# EAGLE schematic main_controller (EAGLE 9.6.2)
AUTHOR: Usama Ali, Jeldrik Lindner; GENERATION: pasta; TITLE: Mainboard; VERSION: 06

## Sheet 1 of 3: Microcontroller
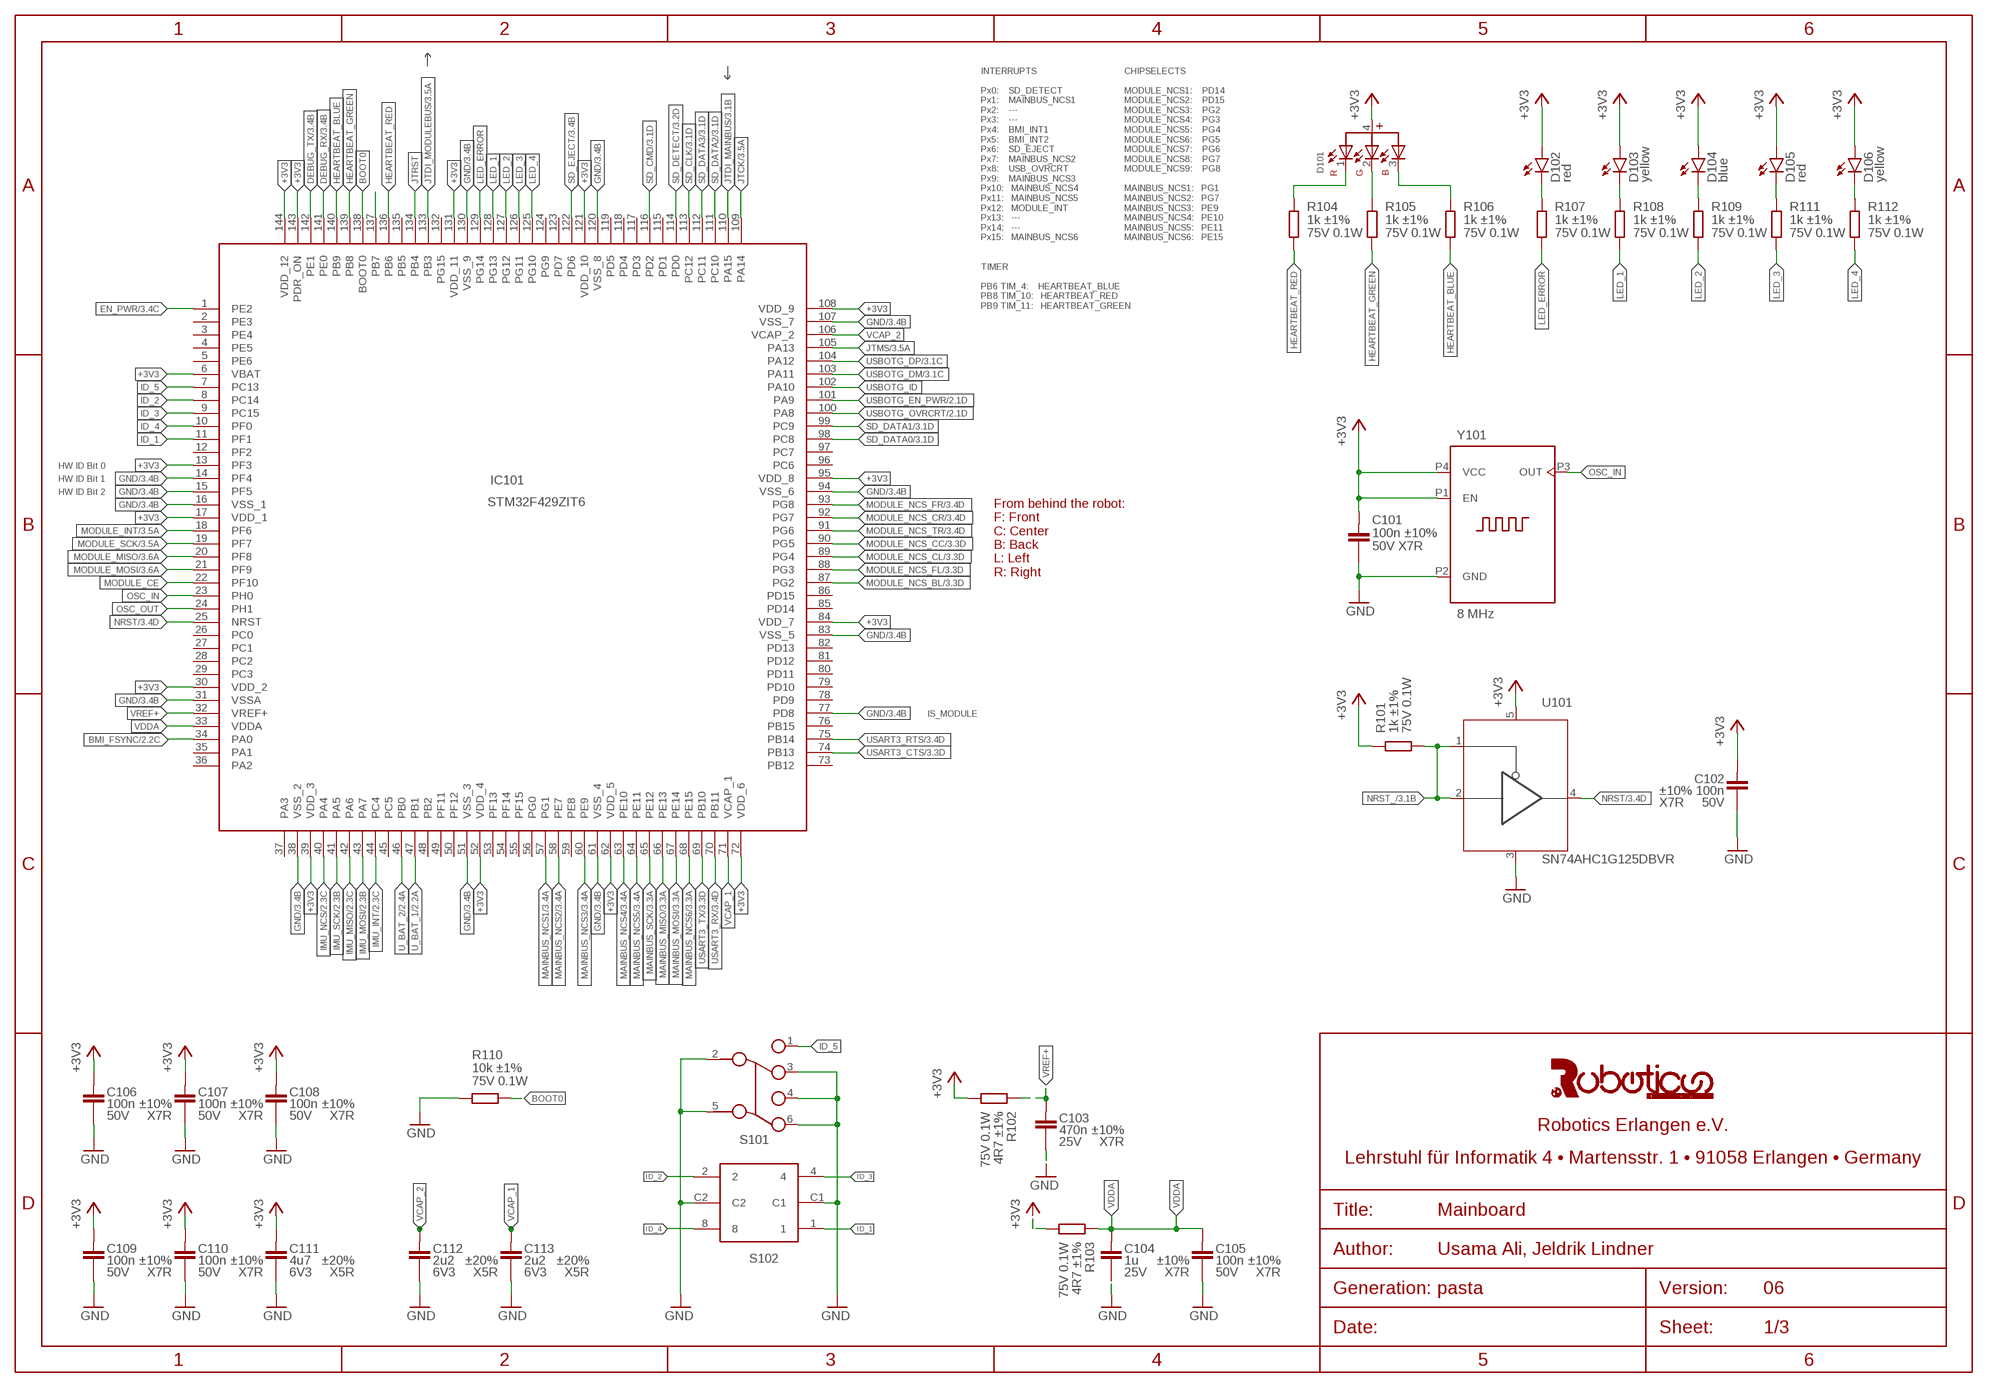
[diagram p0: schematic, sheet 1]

### Parts
C101  100n ±10% 50V X7R  C(100NF,50V,0603)  [C0603]
C102  100n ±10% 50V X7R  C(100NF,50V,0603)  [C0603]
C103  470n ±10% 25V X7R  C(470NF,25V,0603)  [C0603]
C104  1u ±10% 25V X7R  C(1.0UF,25V,0603)  [C0603]
C105  100n ±10% 50V X7R  C(100NF,50V,0603)  [C0603]
C106  100n ±10% 50V X7R  C(100NF,50V,0603)  [C0603]
C107  100n ±10% 50V X7R  C(100NF,50V,0603)  [C0603]
C108  100n ±10% 50V X7R  C(100NF,50V,0603)  [C0603]
C109  100n ±10% 50V X7R  C(100NF,50V,0603)  [C0603]
C110  100n ±10% 50V X7R  C(100NF,50V,0603)  [C0603]
C111  4u7 ±20% 6V3 X5R  C(4.7UF,6.3V,0603)  [C0603]
C112  2u2 ±20% 6V3 X5R  C(2.2UF,6.3V,0603)  [C0603]
C113  2u2 ±20% 6V3 X5R  C(2.2UF,6.3V,0603)  [C0603]
D101  WL-SFCD_0606_150066M153000  [WL-SFCX_0606]
D102  red  LED-RED-CHIPLED_0805  [CHIPLED_0805]
D103  yellow  LED-YELLOW-CHIPLED_0805  [CHIPLED_0805]
D104  blue  LED-BLUE-CHIPLED_0805  [CHIPLED_0805]
D105  red  LED-RED-CHIPLED_0805  [CHIPLED_0805]
D106  yellow  LED-YELLOW-CHIPLED_0805  [CHIPLED_0805]
IC101  STM32F429ZIT6  [QFP50P2200X2200X160-144N]
R101  1k ±1% 75V 0.1W  R(1.0K,75V,0.1W,0603)  [R0603]
R102  4R7 ±1% 75V 0.1W  R(4.7R,75V,0.1W,0603)  [R0603]
R103  4R7 ±1% 75V 0.1W  R(4.7R,75V,0.1W,0603)  [R0603]
R104  1k ±1% 75V 0.1W  R(1.0K,75V,0.1W,0603)  [R0603]
R105  1k ±1% 75V 0.1W  R(1.0K,75V,0.1W,0603)  [R0603]
R106  1k ±1% 75V 0.1W  R(1.0K,75V,0.1W,0603)  [R0603]
R107  1k ±1% 75V 0.1W  R(1.0K,75V,0.1W,0603)  [R0603]
R108  1k ±1% 75V 0.1W  R(1.0K,75V,0.1W,0603)  [R0603]
R109  1k ±1% 75V 0.1W  R(1.0K,75V,0.1W,0603)  [R0603]
R110  10k ±1% 75V 0.1W  R(10K,75V,0.1W,0603)  [R0603]
R111  1k ±1% 75V 0.1W  R(1.0K,75V,0.1W,0603)  [R0603]
R112  1k ±1% 75V 0.1W  R(1.0K,75V,0.1W,0603)  [R0603]
S101  452403012014  [452403012014]
S102  428542320816  [428542320816]
U101  SN74AHC1G125DBVR  [SOT23-5]
Y101  8 MHz  830207192009  [830207192009]

### Nets
+3V3: C101.1 C102.1 C106.1 C107.1 C108.1 C109.1 C110.1 C111.1 D101.4 D102.A D103.A D104.A D105.A D106.A IC101.6(VBAT) IC101.13(PF3) IC101.17(VDD_1) IC101.30(VDD_2) IC101.39(VDD_3) IC101.52(VDD_4) IC101.62(VDD_5) IC101.72(VDD_6) IC101.84(VDD_7) IC101.95(VDD_8) IC101.108(VDD_9) IC101.121(VDD_10) IC101.131(VDD_11) IC101.143(PDR_ON) IC101.144(VDD_12) R101.2 R102.1 R103.1 U101.5(VCC) Y101.P1(EN) Y101.P4(VCC) ; also sheet 2,3
BMI_FSYNC: IC101.34(PA0) ; also sheet 2
BOOT0: IC101.138(BOOT0) R110.1
DEBUG_RX: IC101.141(PE0) ; also sheet 3
DEBUG_TX: IC101.142(PE1) ; also sheet 3
EN_PWR: IC101.1(PE2) ; also sheet 3
GND: C101.2 C102.2 C103.2 C104.2 C105.2 C106.2 C107.2 C108.2 C109.2 C110.2 C111.2 C112.2 C113.2 IC101.14(PF4) IC101.15(PF5) IC101.16(VSS_1) IC101.31(VSSA) IC101.38(VSS_2) IC101.51(VSS_3) IC101.61(VSS_4) IC101.77(PD8) IC101.83(VSS_5) IC101.94(VSS_6) IC101.107(VSS_7) IC101.120(VSS_8) IC101.130(VSS_9) R110.2 S101.2 S101.3 S101.4 S101.5 S101.6 S102.C1 S102.C2 U101.3(GND) Y101.P2(GND) ; also sheet 2,3
HEARTBEAT_BLUE: IC101.140(PB9) R106.1
HEARTBEAT_GREEN: IC101.139(PB8) R105.1
HEARTBEAT_RED: IC101.136(PB6) R104.1
ID_1: IC101.11(PF1) S102.1
ID_2: IC101.8(PC14) S102.2
ID_3: IC101.9(PC15) S102.4
ID_4: IC101.10(PF0) S102.8
ID_5: IC101.7(PC13) S101.1
IMU_INT: IC101.44(PC4) ; also sheet 2,3
IMU_MISO: IC101.42(PA6) ; also sheet 2,3
IMU_MOSI: IC101.43(PA7) ; also sheet 2,3
IMU_NCS: IC101.40(PA4) ; also sheet 2,3
IMU_SCK: IC101.41(PA5) ; also sheet 2,3
JTCK: IC101.109(PA14) ; also sheet 3
JTDI_MAINBUS: IC101.110(PA15) ; also sheet 3
JTDI_MODULEBUS: IC101.133(PB3) ; also sheet 3
JTMS: IC101.105(PA13) ; also sheet 3
JTRST: IC101.134(PB4)
LED_1: IC101.128(PG13) R108.1
LED_2: IC101.127(PG12) R109.1
LED_3: IC101.126(PG11) R111.1
LED_4: IC101.125(PG10) R112.1
LED_ERROR: IC101.129(PG14) R107.1
MAINBUS_MISO: IC101.66(PE13) ; also sheet 3
MAINBUS_MOSI: IC101.67(PE14) ; also sheet 3
MAINBUS_NCS1: IC101.57(PG1) ; also sheet 3
MAINBUS_NCS2: IC101.58(PE7) ; also sheet 3
MAINBUS_NCS3: IC101.60(PE9) ; also sheet 3
MAINBUS_NCS4: IC101.63(PE10) ; also sheet 3
MAINBUS_NCS5: IC101.64(PE11) ; also sheet 3
MAINBUS_NCS6: IC101.68(PE15) ; also sheet 3
MAINBUS_SCK: IC101.65(PE12) ; also sheet 3
MODULE_CE: IC101.22(PF10)
MODULE_INT: IC101.18(PF6) ; also sheet 3
MODULE_MISO: IC101.20(PF8) ; also sheet 3
MODULE_MOSI: IC101.21(PF9) ; also sheet 3
MODULE_NCS_BL: IC101.87(PG2) ; also sheet 3
MODULE_NCS_CC: IC101.90(PG5) ; also sheet 3
MODULE_NCS_CL: IC101.89(PG4) ; also sheet 3
MODULE_NCS_CR: IC101.92(PG7) ; also sheet 3
MODULE_NCS_FL: IC101.88(PG3) ; also sheet 3
MODULE_NCS_FR: IC101.93(PG8) ; also sheet 3
MODULE_NCS_TR: IC101.91(PG6) ; also sheet 3
MODULE_SCK: IC101.19(PF7) ; also sheet 3
N$7: D102.C R107.2
N$9: D103.C R108.2
N$10: D104.C R109.2
N$11: IC101.137(PB7)
N$12: D101.1(R) R104.2
N$13: D101.2(G) R105.2
N$14: D101.3(B) R106.2
N$20: D105.C R111.2
N$21: D106.C R112.2
NRST: IC101.25(NRST) U101.4(O) ; also sheet 3
NRST_: R101.1 U101.1(OE) U101.2(I) ; also sheet 3
OSC_IN: IC101.23(PH0) Y101.P3(OUT)
OSC_OUT: IC101.24(PH1)
SD_CLK: IC101.113(PC12) ; also sheet 3
SD_CMD: IC101.116(PD2) ; also sheet 3
SD_DATA0: IC101.98(PC8) ; also sheet 3
SD_DATA1: IC101.99(PC9) ; also sheet 3
SD_DATA2: IC101.111(PC10) ; also sheet 3
SD_DATA3: IC101.112(PC11) ; also sheet 3
SD_DETECT: IC101.114(PD0) ; also sheet 3
SD_EJECT: IC101.122(PD6) ; also sheet 3
U_BAT_1: IC101.47(PB1) ; also sheet 2
U_BAT_2: IC101.46(PB0) ; also sheet 2
USART3_CTS: IC101.74(PB13) ; also sheet 3
USART3_RTS: IC101.75(PB14) ; also sheet 3
USART3_RX: IC101.70(PB11) ; also sheet 3
USART3_TX: IC101.69(PB10) ; also sheet 3
USBOTG_DM: IC101.103(PA11) ; also sheet 3
USBOTG_DP: IC101.104(PA12) ; also sheet 3
USBOTG_EN_PWR: IC101.101(PA9) ; also sheet 2
USBOTG_ID: IC101.102(PA10)
USBOTG_OVRCRT: IC101.100(PA8) ; also sheet 2
VCAP_1: C113.1 IC101.71(VCAP_1)
VCAP_2: C112.1 IC101.106(VCAP_2)
VDDA: C104.1 C105.1 IC101.33(VDDA) R103.2
VREF+: C103.1 IC101.32(VREF+) R102.2
Unconnected: IC101.2(PE3) IC101.3(PE4) IC101.4(PE5) IC101.5(PE6) IC101.12(PF2) IC101.26(PC0) IC101.27(PC1) IC101.28(PC2) IC101.29(PC3) IC101.35(PA1) IC101.36(PA2) IC101.37(PA3) IC101.45(PC5) IC101.48(PB2) IC101.49(PF11) IC101.50(PF12) IC101.53(PF13) IC101.54(PF14) IC101.55(PF15) IC101.56(PG0) IC101.59(PE8) IC101.73(PB12) IC101.76(PB15) IC101.78(PD9) IC101.79(PD10) IC101.80(PD11) IC101.81(PD12) IC101.82(PD13) IC101.85(PD14) IC101.86(PD15) IC101.96(PC6) IC101.97(PC7) IC101.115(PD1) IC101.117(PD3) IC101.118(PD4) IC101.119(PD5) IC101.123(PD7) IC101.124(PG9) IC101.132(PG15) IC101.135(PB5)

### Notes on the sheet
- INTERRUPTS
  
  Px0:    SD_DETECT
  Px1:    MAINBUS_NCS1
  Px2:    ---
  Px3:    ---
  Px4:    BMI_INT1
  Px5:    BMI_INT2
  Px6:    SD_EJECT
  Px7:    MAINBUS_NCS2
  Px8:    USB_OVRCRT
  Px9:    MAINBUS_NCS3
  Px10:   MAINBUS_NCS4
  Px11:   MAINBUS_NCS5
  Px12:   MODULE_INT
  Px13:   ---
  Px14:   ---
  Px15:   MAINBUS_NCS6
- CHIPSELECTS
  
  MODULE_NCS1:    PD14
  MODULE_NCS2:    PD15
  MODULE_NCS3:    PG2
  MODULE_NCS4:    PG3
  MODULE_NCS5:    PG4
  MODULE_NCS6:    PG5
  MODULE_NCS7:    PG6
  MODULE_NCS8:    PG7
  MODULE_NCS9:    PG8
  
  MAINBUS_NCS1:   PG1
  MAINBUS_NCS2:   PG7
  MAINBUS_NCS3:   PE9
  MAINBUS_NCS4:   PE10
  MAINBUS_NCS5:   PE11
  MAINBUS_NCS6:   PE15
- TIMER
  
  PB6 TIM_4:    HEARTBEAT_BLUE
  PB8 TIM_10:   HEARTBEAT_RED
  PB9 TIM_11:   HEARTBEAT_GREEN
- HW ID Bit 0
- HW ID Bit 1
- HW ID Bit 2
- From behind the robot:
  F: Front
  C: Center
  B: Back
  L: Left
  R: Right
- IS_MODULE

## Sheet 2 of 3: Interface Driver
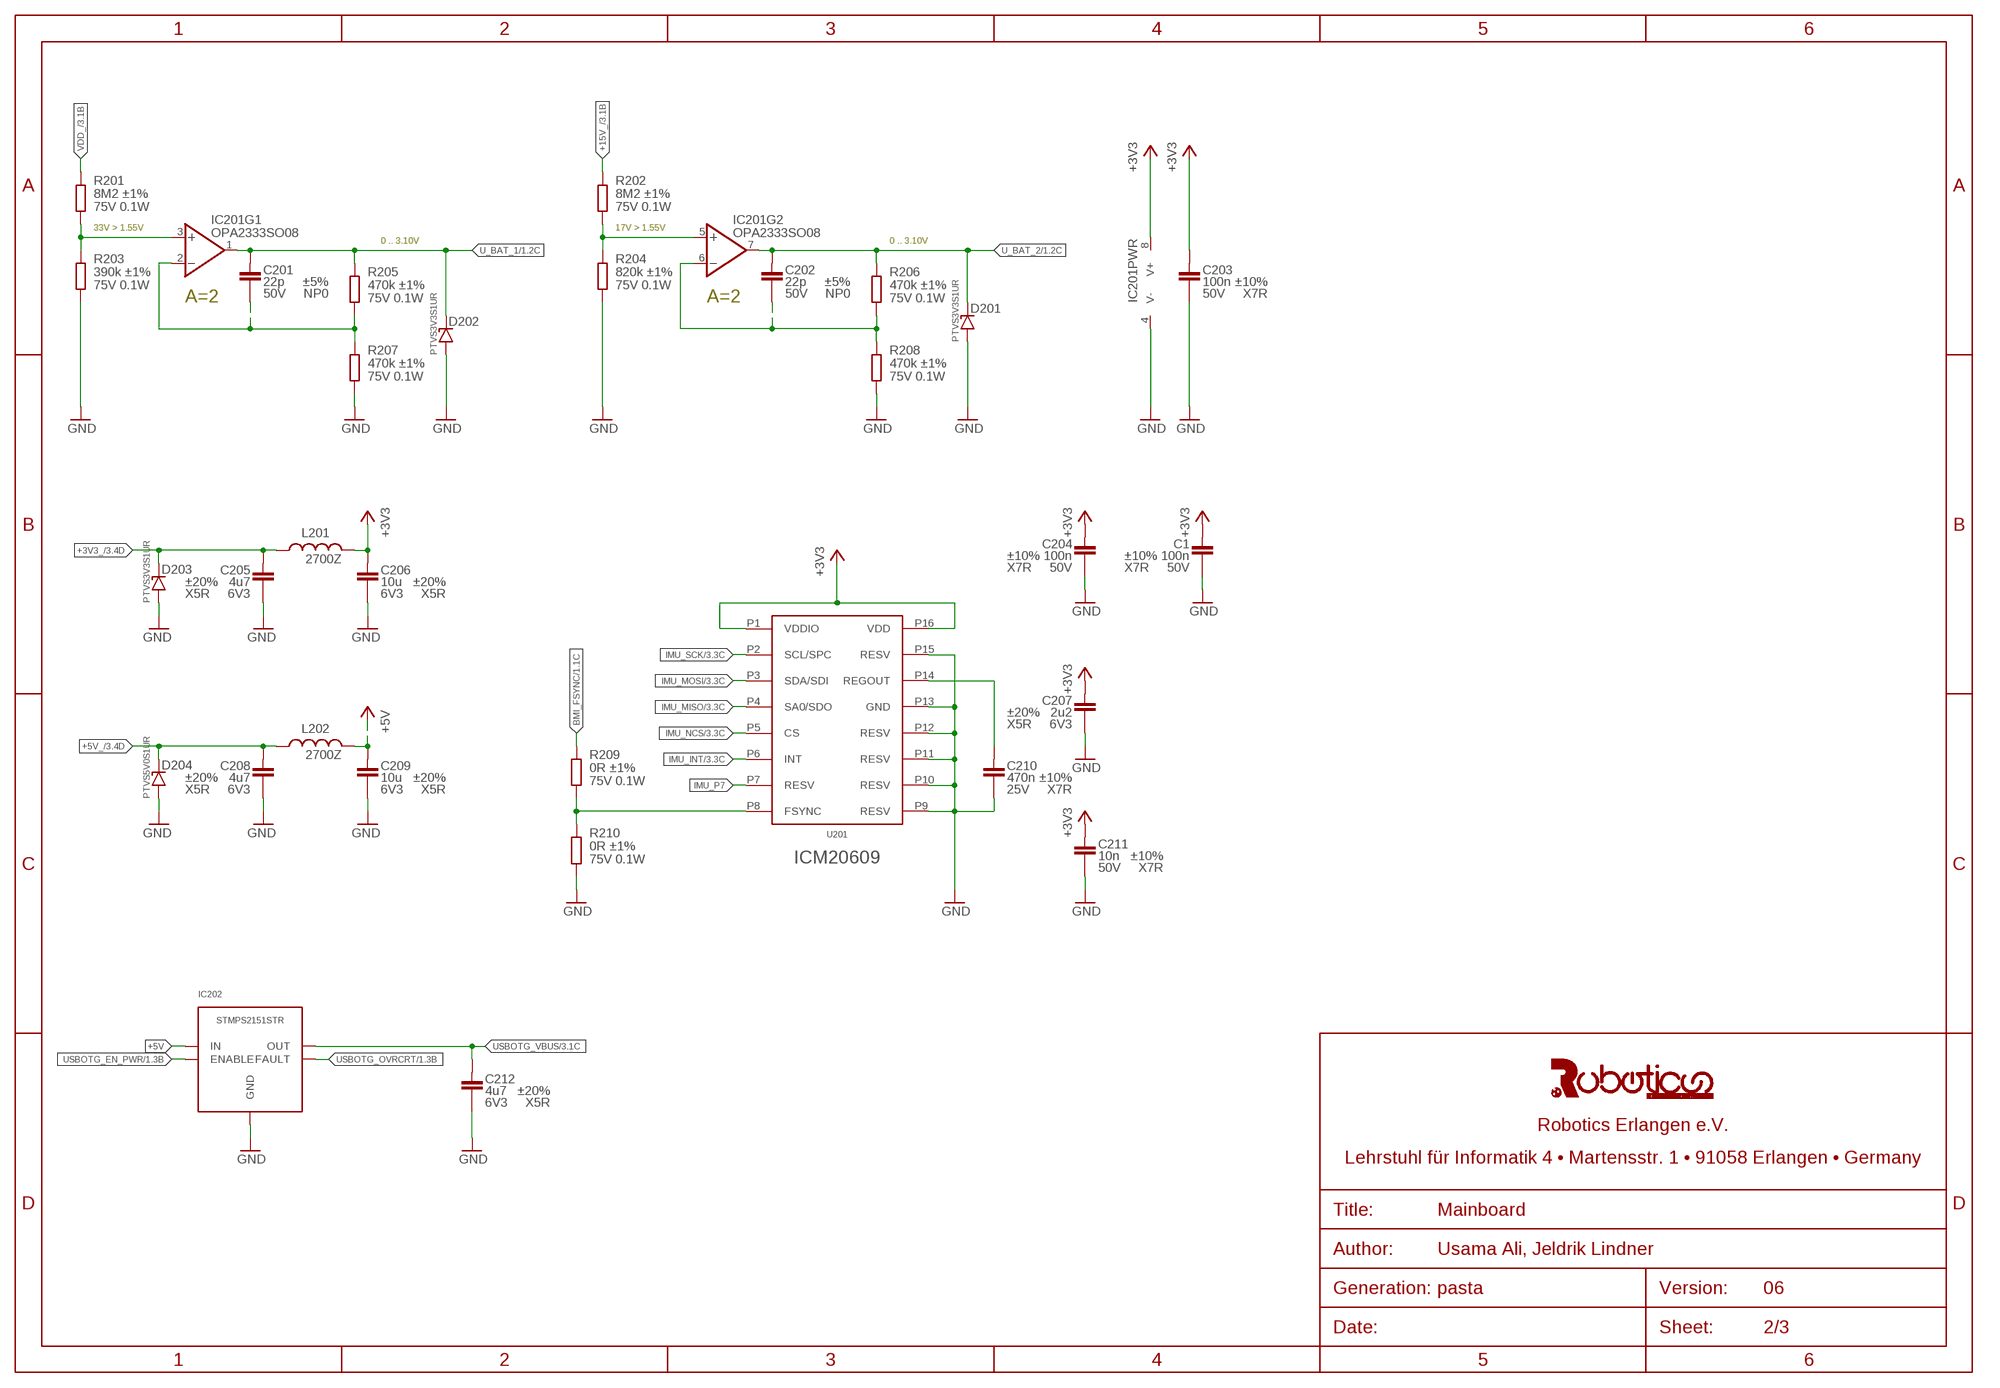
[diagram p1: schematic, sheet 2]

### Parts
C1  100n ±10% 50V X7R  C(100NF,50V,0603)  [C0603]
C201  22p ±5% 50V NP0  C(22PF,50V,0603)  [C0603]
C202  22p ±5% 50V NP0  C(22PF,50V,0603)  [C0603]
C203  100n ±10% 50V X7R  C(100NF,50V,0603)  [C0603]
C204  100n ±10% 50V X7R  C(100NF,50V,0603)  [C0603]
C205  4u7 ±20% 6V3 X5R  C(4.7UF,6.3V,0603)  [C0603]
C206  10u ±20% 6V3 X5R  C(10UF,6.3V,0603)  [C0603]
C207  2u2 ±20% 6V3 X5R  C(2.2UF,6.3V,0603)  [C0603]
C208  4u7 ±20% 6V3 X5R  C(4.7UF,6.3V,0603)  [C0603]
C209  10u ±20% 6V3 X5R  C(10UF,6.3V,0603)  [C0603]
C210  470n ±10% 25V X7R  C(470NF,25V,0603)  [C0603]
C211  10n ±10% 50V X7R  C(10NF,50V,0603)  [C0603]
C212  4u7 ±20% 6V3 X5R  C(4.7UF,6.3V,0603)  [C0603]
D201  PTVS3V3S1UR  [SOD123]
D202  PTVS3V3S1UR  [SOD123]
D203  PTVS3V3S1UR  [SOD123]
D204  PTVS5V0S1UR  [SOD123]
IC201  OPA2333SO08  [SO08]
IC202  STMPS2151STR  [SOT23-5:1]
L201  2700Z  742861160  [WE-CBF_0603(W=2.6)]
L202  2700Z  742861210  [WE-CBF_0603(W=2.6)]
R201  8M2 ±1% 75V 0.1W  R(8.2M,75V,0.1W,0603)  [R0603]
R202  8M2 ±1% 75V 0.1W  R(8.2M,75V,0.1W,0603)  [R0603]
R203  390k ±1% 75V 0.1W  R(390K,75V,0.1W,0603)  [R0603]
R204  820k ±1% 75V 0.1W  R(820K,75V,0.1W,0603)  [R0603]
R205  470k ±1% 75V 0.1W  R(470K,75V,0.1W,0603)  [R0603]
R206  470k ±1% 75V 0.1W  R(470K,75V,0.1W,0603)  [R0603]
R207  470k ±1% 75V 0.1W  R(470K,75V,0.1W,0603)  [R0603]
R208  470k ±1% 75V 0.1W  R(470K,75V,0.1W,0603)  [R0603]
R209  0R ±1% 75V 0.1W  R(0R,75V,0.1W,0603)  [R0603]
R210  0R ±1% 75V 0.1W  R(0R,75V,0.1W,0603)  [R0603]
U201  ICM20609  [ICM20609]

### Nets
+3V3: C1.1 C203.1 C204.1 C206.1 C207.1 C211.1 IC201.8(PWR:V+) L201.1 U201.P1(VDDIO) U201.P16(VDD) ; also sheet 1,3
+3V3_: C205.1 D203.C(KATHODE) L201.2 ; also sheet 3
+5V: C209.1 IC202.5(IN) L202.1
+5V_: C208.1 D204.C(KATHODE) L202.2 ; also sheet 3
+15V_: R202.2 ; also sheet 3
BMI_FSYNC: R209.2 ; also sheet 1
GND: C1.2 C203.2 C204.2 C205.2 C206.2 C207.2 C208.2 C209.2 C210.2 C211.2 C212.2 D201.A(ANODE) D202.A(ANODE) D203.A(ANODE) D204.A(ANODE) IC201.4(PWR:V-) IC202.2(GND) R203.1 R204.1 R207.1 R208.1 R210.1 U201.P9(RESV) U201.P10(RESV) U201.P11(RESV) U201.P12(RESV) U201.P13(GND) U201.P15(RESV) ; also sheet 1,3
IMU_INT: U201.P6(INT) ; also sheet 1,3
IMU_MISO: U201.P4(SA0/SDO) ; also sheet 1,3
IMU_MOSI: U201.P3(SDA/SDI) ; also sheet 1,3
IMU_NCS: U201.P5(CS) ; also sheet 1,3
IMU_P7: U201.P7(RESV)
IMU_SCK: U201.P2(SCL/SPC) ; also sheet 1,3
N$1: IC201.3(+IN) R201.1 R203.2
N$2: C201.2 IC201.2(-IN) R205.1 R207.2
N$3: C202.2 IC201.6(-IN) R206.1 R208.2
N$4: IC201.5(+IN) R202.1 R204.2
N$5: R209.1 R210.2 U201.P8(FSYNC)
N$8: C210.1 U201.P14(REGOUT)
U_BAT_1: C201.1 D202.C(KATHODE) IC201.1(OUT) R205.2 ; also sheet 1
U_BAT_2: C202.1 D201.C(KATHODE) IC201.7(OUT) R206.2 ; also sheet 1
USBOTG_EN_PWR: IC202.4(ENABLE) ; also sheet 1
USBOTG_OVRCRT: IC202.3(FAULT) ; also sheet 1
USBOTG_VBUS: C212.1 IC202.1(OUT) ; also sheet 3
VDD_: R201.2 ; also sheet 3

### Notes on the sheet
- 33V > 1.55V | 17V > 1.55V
- 0 .. 3.10V | 0 .. 3.10V
- A=2 | A=2

## Sheet 3 of 3: Connectors
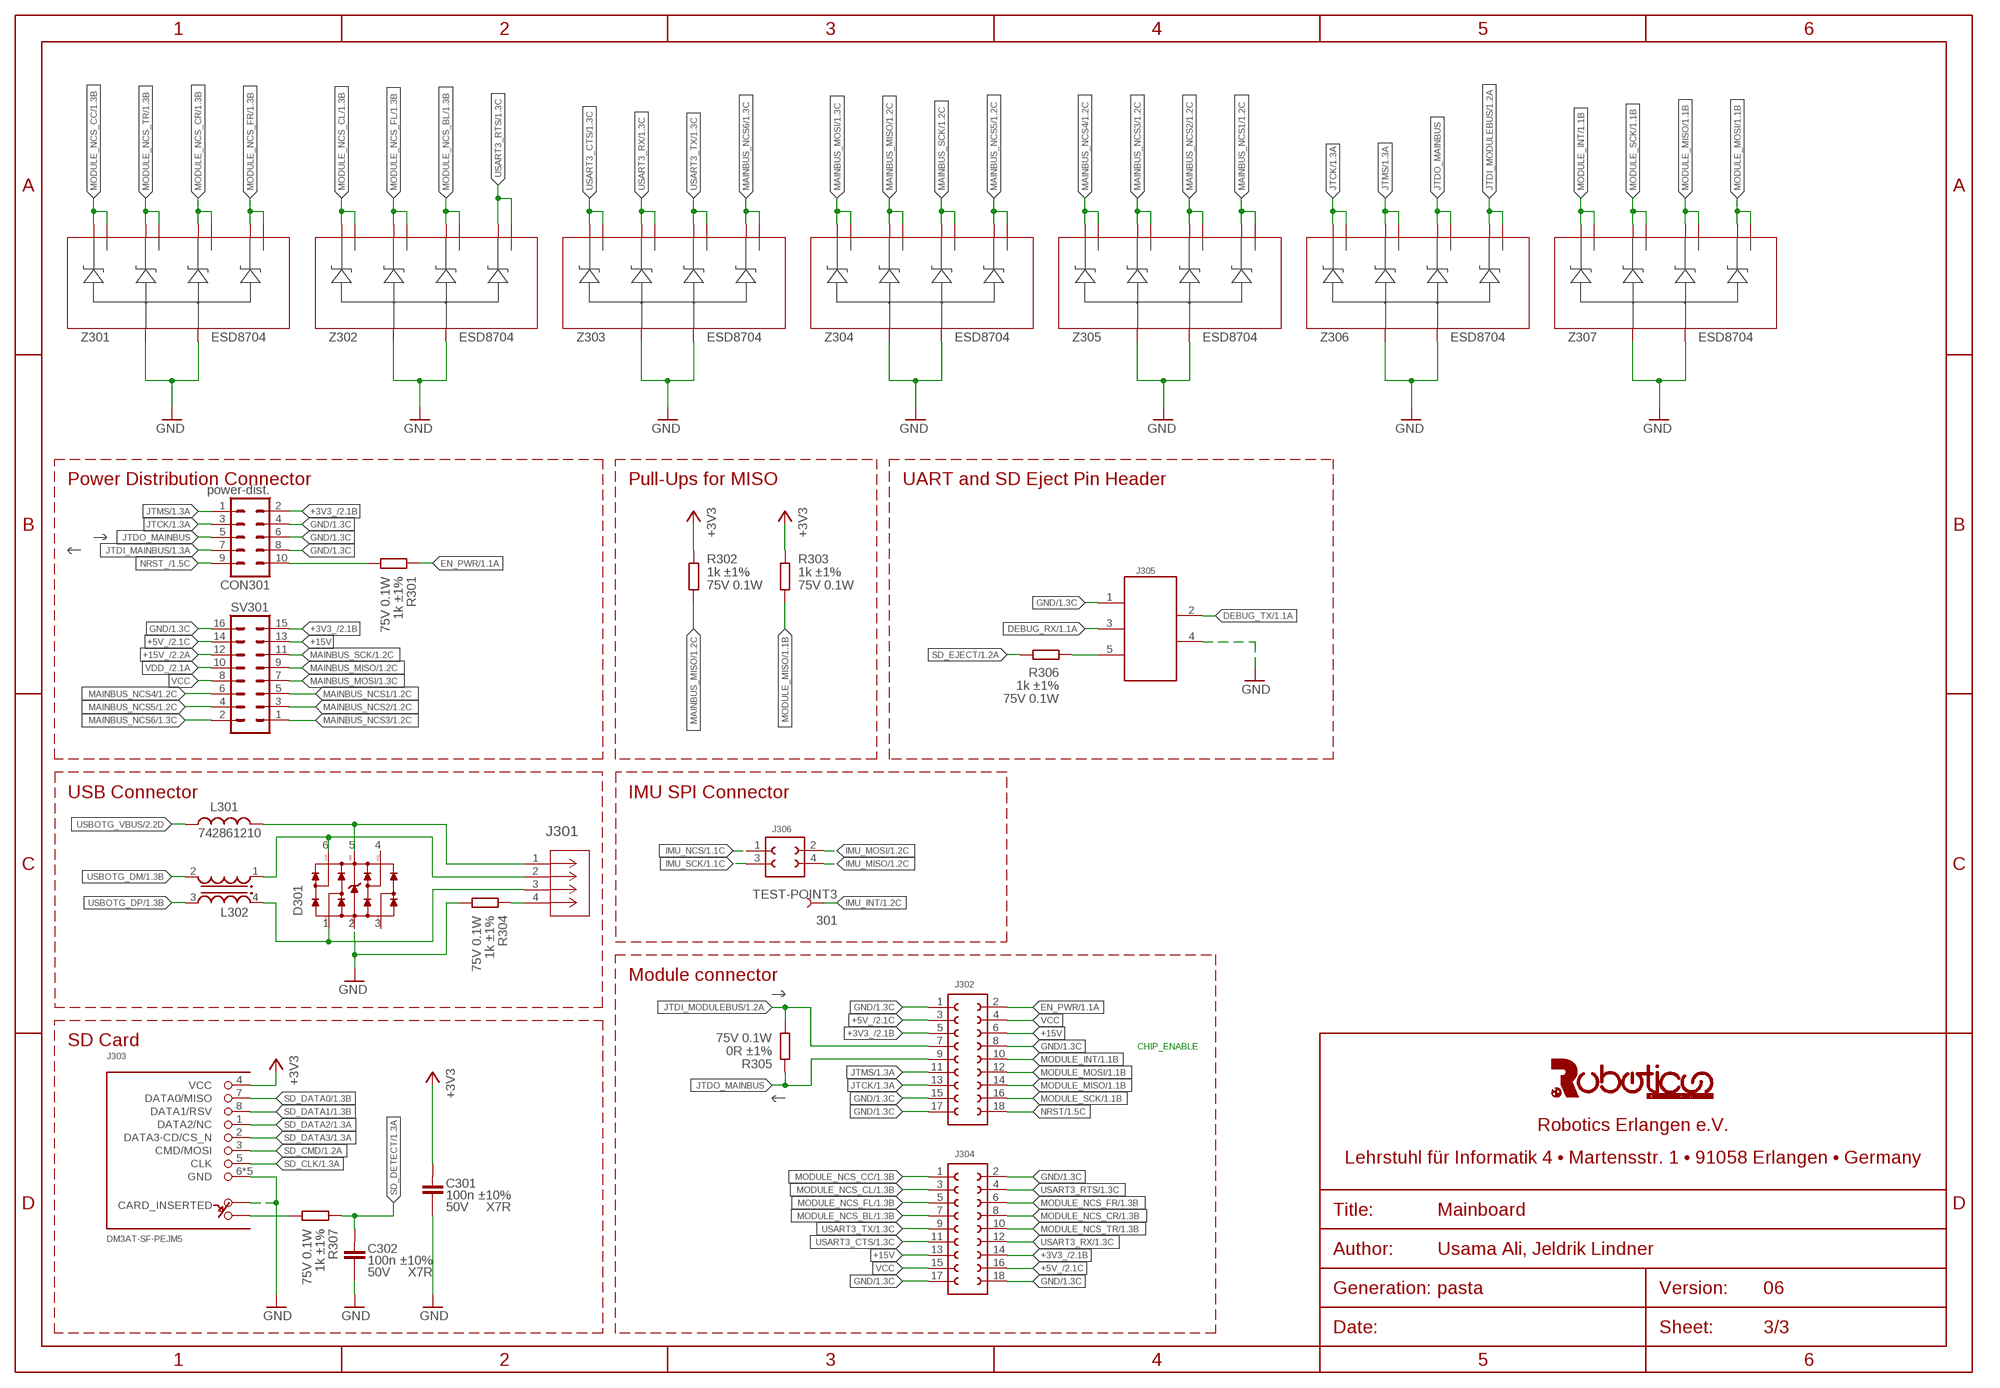
[diagram p2: schematic, sheet 3]

### Parts
301  TEST-POINT3  [PAD.03X.03]
C301  100n ±10% 50V X7R  C(100NF,50V,0603)  [C0603]
C302  100n ±10% 50V X7R  C(100NF,50V,0603)  [C0603]
CON301  power-dist.  MA05-2MA05-2  [MA05-2]
D301  WE-TVS_824001  [WE-TVS_SOT23-6L]
J301  530480410  [CON_530480410_MOL]
J302  610018243021  [610X1821821]
J303  DM3AT-SF-PEJM5  [DM3AT-SF-PEJM5]
J304  610018243021  [610X1821821]
J305  61000618221  [61000618221]
J306  623X0421021  [623X0421021]
L301  742861210  [WE-CBF_0603(W=2.6)]
L302  WE-CNSW_1206_744232090  [WE-CNSW_1206]
R301  1k ±1% 75V 0.1W  R(1.0K,75V,0.1W,0603)  [R0603]
R302  1k ±1% 75V 0.1W  R(1.0K,75V,0.1W,0603)  [R0603]
R303  1k ±1% 75V 0.1W  R(1.0K,75V,0.1W,0603)  [R0603]
R304  1k ±1% 75V 0.1W  R(1.0K,75V,0.1W,0603)  [R0603]
R305  0R ±1% 75V 0.1W  R(0R,75V,0.1W,0603)  [R0603]
R306  1k ±1% 75V 0.1W  R(1.0K,75V,0.1W,0603)  [R0603]
R307  1k ±1% 75V 0.1W  R(1.0K,75V,0.1W,0603)  [R0603]
SV301  MA08-2  [MA08-2]
Z301  ESD8704  [UDFN10]
Z302  ESD8704  [UDFN10]
Z303  ESD8704  [UDFN10]
Z304  ESD8704  [UDFN10]
Z305  ESD8704  [UDFN10]
Z306  ESD8704  [UDFN10]
Z307  ESD8704  [UDFN10]

### Nets
+3V3: C301.1 J303.4(VCC) R302.2 R303.2 ; also sheet 1,2
+3V3_: CON301.2 J302.5 J304.14 SV301.15 ; also sheet 2
+5V_: J302.3 J304.16 SV301.14 ; also sheet 2
+15V: J302.6 J304.13 SV301.13
+15V_: SV301.12 ; also sheet 2
DEBUG_RX: J305.3 ; also sheet 1
DEBUG_TX: J305.2 ; also sheet 1
EN_PWR: J302.2 R301.2 ; also sheet 1
GND: C301.2 C302.2 CON301.4 CON301.6 CON301.8 D301.2(GND) J302.1 J302.8 J302.15 J302.17 J303.6(GND) J303.A J303.MOUNT0(GND) J303.MOUNT1(GND) J303.MOUNT2(GND) J303.MOUNT3(GND) J304.2 J304.17 J304.18 J305.1 J305.4 R304.1 SV301.16 Z301.3(A) Z301.8(A) Z302.3(A) Z302.8(A) Z303.3(A) Z303.8(A) Z304.3(A) Z304.8(A) Z305.3(A) Z305.8(A) Z306.3(A) Z306.8(A) Z307.3(A) Z307.8(A) ; also sheet 1,2
IMU_INT: 301.P$1 ; also sheet 1,2
IMU_MISO: J306.4 ; also sheet 1,2
IMU_MOSI: J306.2 ; also sheet 1,2
IMU_NCS: J306.1 ; also sheet 1,2
IMU_SCK: J306.3 ; also sheet 1,2
JTCK: CON301.3 J302.13 Z306.1(C1) Z306.10(D1) ; also sheet 1
JTDI_MAINBUS: CON301.7 ; also sheet 1
JTDI_MODULEBUS: J302.7 R305.1 Z306.5(C4) Z306.6(D4) ; also sheet 1
JTDO_MAINBUS: CON301.5 J302.9 R305.2 Z306.4(C3) Z306.7(D3)
JTMS: CON301.1 J302.11 Z306.2(C2) Z306.9(D2) ; also sheet 1
MAINBUS_MISO: R302.1 SV301.9 Z304.2(C2) Z304.9(D2) ; also sheet 1
MAINBUS_MOSI: SV301.7 Z304.1(C1) Z304.10(D1) ; also sheet 1
MAINBUS_NCS1: SV301.5 Z305.5(C4) Z305.6(D4) ; also sheet 1
MAINBUS_NCS2: SV301.3 Z305.4(C3) Z305.7(D3) ; also sheet 1
MAINBUS_NCS3: SV301.1 Z305.2(C2) Z305.9(D2) ; also sheet 1
MAINBUS_NCS4: SV301.6 Z305.1(C1) Z305.10(D1) ; also sheet 1
MAINBUS_NCS5: SV301.4 Z304.5(C4) Z304.6(D4) ; also sheet 1
MAINBUS_NCS6: SV301.2 Z303.5(C4) Z303.6(D4) ; also sheet 1
MAINBUS_SCK: SV301.11 Z304.4(C3) Z304.7(D3) ; also sheet 1
MODULE_INT: J302.10 Z307.1(C1) Z307.10(D1) ; also sheet 1
MODULE_MISO: J302.14 R303.1 Z307.4(C3) Z307.7(D3) ; also sheet 1
MODULE_MOSI: J302.12 Z307.5(C4) Z307.6(D4) ; also sheet 1
MODULE_NCS_BL: J304.7 Z302.4(C3) Z302.7(D3) ; also sheet 1
MODULE_NCS_CC: J304.1 Z301.1(C1) Z301.10(D1) ; also sheet 1
MODULE_NCS_CL: J304.3 Z302.1(C1) Z302.10(D1) ; also sheet 1
MODULE_NCS_CR: J304.8 Z301.4(C3) Z301.7(D3) ; also sheet 1
MODULE_NCS_FL: J304.5 Z302.2(C2) Z302.9(D2) ; also sheet 1
MODULE_NCS_FR: J304.6 Z301.5(C4) Z301.6(D4) ; also sheet 1
MODULE_NCS_TR: J304.10 Z301.2(C2) Z301.9(D2) ; also sheet 1
MODULE_SCK: J302.16 Z307.2(C2) Z307.9(D2) ; also sheet 1
N$6: CON301.10 R301.1
N$15: D301.6 J301.2 L302.1
N$16: J305.5 R306.1
N$17: J301.4 R304.2
N$18: D301.1 J301.3 L302.4
N$19: D301.5(VDD) J301.1 L301.2
NRST: J302.18 ; also sheet 1
NRST_: CON301.9 ; also sheet 1
SD_CARD_DETECT_GND: J303.B R307.1
SD_CLK: J303.5(CLK) ; also sheet 1
SD_CMD: J303.3(CMD/MOSI) ; also sheet 1
SD_DATA0: J303.7(DATA0/MISO) ; also sheet 1
SD_DATA1: J303.8(DATA1/RSV) ; also sheet 1
SD_DATA2: J303.1(DATA2/NC) ; also sheet 1
SD_DATA3: J303.2(DATA3-CD/CS_N) ; also sheet 1
SD_DETECT: C302.1 R307.2 ; also sheet 1
SD_EJECT: R306.2 ; also sheet 1
USART3_CTS: J304.11 Z303.1(C1) Z303.10(D1) ; also sheet 1
USART3_RTS: J304.4 Z302.5(C4) Z302.6(D4) ; also sheet 1
USART3_RX: J304.12 Z303.2(C2) Z303.9(D2) ; also sheet 1
USART3_TX: J304.9 Z303.4(C3) Z303.7(D3) ; also sheet 1
USBOTG_DM: L302.2 ; also sheet 1
USBOTG_DP: L302.3 ; also sheet 1
USBOTG_VBUS: L301.1 ; also sheet 2
VCC: J302.4 J304.15 SV301.8
VDD_: SV301.10 ; also sheet 2
Unconnected: D301.3 D301.4

### Notes on the sheet
- Power Distribution Connector | Pull-Ups for MISO | UART and SD Eject Pin Header
- USB Connector | IMU SPI Connector
- Module connector
- SD Card
- CHIP_ENABLE

## Library data of the parts
301 = main_controller:TEST-POINT
C1 C101 C102 C105-C110 C203 C204 C301 C302 = capacitors:C(*?): Robotics Erlangen Capacitor Library This library provides a list of predefined capacitors with the following features: It is guaranteed that the capacitor exists with the given value, voltage rating and package size If you choose the capacitor you need (e.g. 2u2 with at least 50V) the package will be automatically choosen The manufacturer's data is automatically added so that exactly that capacitor will be ordered The value of the capacitor will be automatically filled with the most relevant data To choose a capacitor, you need to think about the voltage it must be rated for acc. to your application. Use below table to get a minimum voltage rating for the capacitor, depending on the maximum voltage that will be applied to it in your application. Maximum Voltage Applied Notes Minimum Voltage Rating ≤ 3.3V ≥ 6V3 ≤ 5.0V ≥ 10V ≤ 16.8V ≥ 25V ≤ 33.6V Includes all signals that are at max. VCC ≥ 50V After you determined the minimum voltage rating of the capacitor, search for it in the database of this library and choose the first one, that has at least that rating. The library is primarily sorted by capacitance values. Never change the value of predefined capacitors! Note: If your project requires a very specific capacitor (e.g. low tolerance, high voltage or E-24 upwards), then choose any of the predefined empty devices C(0402), C(0603), C(0805), C(1206), C(1210), or C(1812). Always set the attributes MF, MPN and VALUE for custom capacitors!; CAPACITANCE: 100n; DIELECTRIC: X7R; LINE1: 100n ±10%; LINE2: 50V X7R; MF: Würth Elektronik; MPN: 885012206095; TOLERANCE: ±10%; VOLTAGE: 50V
C103 C210 = capacitors:C(*?): Robotics Erlangen Capacitor Library This library provides a list of predefined capacitors with the following features: It is guaranteed that the capacitor exists with the given value, voltage rating and package size If you choose the capacitor you need (e.g. 2u2 with at least 50V) the package will be automatically choosen The manufacturer's data is automatically added so that exactly that capacitor will be ordered The value of the capacitor will be automatically filled with the most relevant data To choose a capacitor, you need to think about the voltage it must be rated for acc. to your application. Use below table to get a minimum voltage rating for the capacitor, depending on the maximum voltage that will be applied to it in your application. Maximum Voltage Applied Notes Minimum Voltage Rating ≤ 3.3V ≥ 6V3 ≤ 5.0V ≥ 10V ≤ 16.8V ≥ 25V ≤ 33.6V Includes all signals that are at max. VCC ≥ 50V After you determined the minimum voltage rating of the capacitor, search for it in the database of this library and choose the first one, that has at least that rating. The library is primarily sorted by capacitance values. Never change the value of predefined capacitors! Note: If your project requires a very specific capacitor (e.g. low tolerance, high voltage or E-24 upwards), then choose any of the predefined empty devices C(0402), C(0603), C(0805), C(1206), C(1210), or C(1812). Always set the attributes MF, MPN and VALUE for custom capacitors!; CAPACITANCE: 470n; DIELECTRIC: X7R; LINE1: 470n ±10%; LINE2: 25V X7R; MF: Würth Elektronik; MPN: 885012206075; TOLERANCE: ±10%; VOLTAGE: 25V
C104 = capacitors:C(*?): Robotics Erlangen Capacitor Library This library provides a list of predefined capacitors with the following features: It is guaranteed that the capacitor exists with the given value, voltage rating and package size If you choose the capacitor you need (e.g. 2u2 with at least 50V) the package will be automatically choosen The manufacturer's data is automatically added so that exactly that capacitor will be ordered The value of the capacitor will be automatically filled with the most relevant data To choose a capacitor, you need to think about the voltage it must be rated for acc. to your application. Use below table to get a minimum voltage rating for the capacitor, depending on the maximum voltage that will be applied to it in your application. Maximum Voltage Applied Notes Minimum Voltage Rating ≤ 3.3V ≥ 6V3 ≤ 5.0V ≥ 10V ≤ 16.8V ≥ 25V ≤ 33.6V Includes all signals that are at max. VCC ≥ 50V After you determined the minimum voltage rating of the capacitor, search for it in the database of this library and choose the first one, that has at least that rating. The library is primarily sorted by capacitance values. Never change the value of predefined capacitors! Note: If your project requires a very specific capacitor (e.g. low tolerance, high voltage or E-24 upwards), then choose any of the predefined empty devices C(0402), C(0603), C(0805), C(1206), C(1210), or C(1812). Always set the attributes MF, MPN and VALUE for custom capacitors!; CAPACITANCE: 1u; DIELECTRIC: X7R; LINE1: 1u ±10%; LINE2: 25V X7R; MF: Würth Elektronik; MPN: 885012206076; TOLERANCE: ±10%; VOLTAGE: 25V
C111 C205 C208 C212 = capacitors:C(*?): Robotics Erlangen Capacitor Library This library provides a list of predefined capacitors with the following features: It is guaranteed that the capacitor exists with the given value, voltage rating and package size If you choose the capacitor you need (e.g. 2u2 with at least 50V) the package will be automatically choosen The manufacturer's data is automatically added so that exactly that capacitor will be ordered The value of the capacitor will be automatically filled with the most relevant data To choose a capacitor, you need to think about the voltage it must be rated for acc. to your application. Use below table to get a minimum voltage rating for the capacitor, depending on the maximum voltage that will be applied to it in your application. Maximum Voltage Applied Notes Minimum Voltage Rating ≤ 3.3V ≥ 6V3 ≤ 5.0V ≥ 10V ≤ 16.8V ≥ 25V ≤ 33.6V Includes all signals that are at max. VCC ≥ 50V After you determined the minimum voltage rating of the capacitor, search for it in the database of this library and choose the first one, that has at least that rating. The library is primarily sorted by capacitance values. Never change the value of predefined capacitors! Note: If your project requires a very specific capacitor (e.g. low tolerance, high voltage or E-24 upwards), then choose any of the predefined empty devices C(0402), C(0603), C(0805), C(1206), C(1210), or C(1812). Always set the attributes MF, MPN and VALUE for custom capacitors!; CAPACITANCE: 4u7; DIELECTRIC: X5R; LINE1: 4u7 ±20%; LINE2: 6V3 X5R; MF: Würth Elektronik; MPN: 885012106005; TOLERANCE: ±20%; VOLTAGE: 6V3
C112 C113 C207 = capacitors:C(*?): Robotics Erlangen Capacitor Library This library provides a list of predefined capacitors with the following features: It is guaranteed that the capacitor exists with the given value, voltage rating and package size If you choose the capacitor you need (e.g. 2u2 with at least 50V) the package will be automatically choosen The manufacturer's data is automatically added so that exactly that capacitor will be ordered The value of the capacitor will be automatically filled with the most relevant data To choose a capacitor, you need to think about the voltage it must be rated for acc. to your application. Use below table to get a minimum voltage rating for the capacitor, depending on the maximum voltage that will be applied to it in your application. Maximum Voltage Applied Notes Minimum Voltage Rating ≤ 3.3V ≥ 6V3 ≤ 5.0V ≥ 10V ≤ 16.8V ≥ 25V ≤ 33.6V Includes all signals that are at max. VCC ≥ 50V After you determined the minimum voltage rating of the capacitor, search for it in the database of this library and choose the first one, that has at least that rating. The library is primarily sorted by capacitance values. Never change the value of predefined capacitors! Note: If your project requires a very specific capacitor (e.g. low tolerance, high voltage or E-24 upwards), then choose any of the predefined empty devices C(0402), C(0603), C(0805), C(1206), C(1210), or C(1812). Always set the attributes MF, MPN and VALUE for custom capacitors!; CAPACITANCE: 2u2; DIELECTRIC: X5R; LINE1: 2u2 ±20%; LINE2: 6V3 X5R; MF: Würth Elektronik; MPN: 885012106004; TOLERANCE: ±20%; VOLTAGE: 6V3
C201 C202 = capacitors:C(*?): Robotics Erlangen Capacitor Library This library provides a list of predefined capacitors with the following features: It is guaranteed that the capacitor exists with the given value, voltage rating and package size If you choose the capacitor you need (e.g. 2u2 with at least 50V) the package will be automatically choosen The manufacturer's data is automatically added so that exactly that capacitor will be ordered The value of the capacitor will be automatically filled with the most relevant data To choose a capacitor, you need to think about the voltage it must be rated for acc. to your application. Use below table to get a minimum voltage rating for the capacitor, depending on the maximum voltage that will be applied to it in your application. Maximum Voltage Applied Notes Minimum Voltage Rating ≤ 3.3V ≥ 6V3 ≤ 5.0V ≥ 10V ≤ 16.8V ≥ 25V ≤ 33.6V Includes all signals that are at max. VCC ≥ 50V After you determined the minimum voltage rating of the capacitor, search for it in the database of this library and choose the first one, that has at least that rating. The library is primarily sorted by capacitance values. Never change the value of predefined capacitors! Note: If your project requires a very specific capacitor (e.g. low tolerance, high voltage or E-24 upwards), then choose any of the predefined empty devices C(0402), C(0603), C(0805), C(1206), C(1210), or C(1812). Always set the attributes MF, MPN and VALUE for custom capacitors!; CAPACITANCE: 22p; DIELECTRIC: NP0; LINE1: 22p ±5%; LINE2: 50V NP0; MF: Würth Elektronik; MPN: 885012006053; TOLERANCE: ±5%; VOLTAGE: 50V
C206 C209 = capacitors:C(*?): Robotics Erlangen Capacitor Library This library provides a list of predefined capacitors with the following features: It is guaranteed that the capacitor exists with the given value, voltage rating and package size If you choose the capacitor you need (e.g. 2u2 with at least 50V) the package will be automatically choosen The manufacturer's data is automatically added so that exactly that capacitor will be ordered The value of the capacitor will be automatically filled with the most relevant data To choose a capacitor, you need to think about the voltage it must be rated for acc. to your application. Use below table to get a minimum voltage rating for the capacitor, depending on the maximum voltage that will be applied to it in your application. Maximum Voltage Applied Notes Minimum Voltage Rating ≤ 3.3V ≥ 6V3 ≤ 5.0V ≥ 10V ≤ 16.8V ≥ 25V ≤ 33.6V Includes all signals that are at max. VCC ≥ 50V After you determined the minimum voltage rating of the capacitor, search for it in the database of this library and choose the first one, that has at least that rating. The library is primarily sorted by capacitance values. Never change the value of predefined capacitors! Note: If your project requires a very specific capacitor (e.g. low tolerance, high voltage or E-24 upwards), then choose any of the predefined empty devices C(0402), C(0603), C(0805), C(1206), C(1210), or C(1812). Always set the attributes MF, MPN and VALUE for custom capacitors!; CAPACITANCE: 10u; DIELECTRIC: X5R; LINE1: 10u ±20%; LINE2: 6V3 X5R; MF: Würth Elektronik; MPN: 885012106006; TOLERANCE: ±20%; VOLTAGE: 6V3
C211 = capacitors:C(*?): Robotics Erlangen Capacitor Library This library provides a list of predefined capacitors with the following features: It is guaranteed that the capacitor exists with the given value, voltage rating and package size If you choose the capacitor you need (e.g. 2u2 with at least 50V) the package will be automatically choosen The manufacturer's data is automatically added so that exactly that capacitor will be ordered The value of the capacitor will be automatically filled with the most relevant data To choose a capacitor, you need to think about the voltage it must be rated for acc. to your application. Use below table to get a minimum voltage rating for the capacitor, depending on the maximum voltage that will be applied to it in your application. Maximum Voltage Applied Notes Minimum Voltage Rating ≤ 3.3V ≥ 6V3 ≤ 5.0V ≥ 10V ≤ 16.8V ≥ 25V ≤ 33.6V Includes all signals that are at max. VCC ≥ 50V After you determined the minimum voltage rating of the capacitor, search for it in the database of this library and choose the first one, that has at least that rating. The library is primarily sorted by capacitance values. Never change the value of predefined capacitors! Note: If your project requires a very specific capacitor (e.g. low tolerance, high voltage or E-24 upwards), then choose any of the predefined empty devices C(0402), C(0603), C(0805), C(1206), C(1210), or C(1812). Always set the attributes MF, MPN and VALUE for custom capacitors!; CAPACITANCE: 10n; DIELECTRIC: X7R; LINE1: 10n ±10%; LINE2: 50V X7R; MF: Würth Elektronik; MPN: 885012206089; TOLERANCE: ±10%; VOLTAGE: 50V
CON301 = main_controller:MA05-2: PIN HEADER; MF: Würth Elektronik; MPN: 61301021121
D101 = main_controller:WL-SFCD_0606: WL-SFCD SMD Full-color Chip LED Diffused <http://katalog.we-online.de/media/images/v2/Family_WL-SFCD.jpg> Details see: http://katalog.we-online.de/en/led/WL-SFCD Created By Yingchun,Shan 2016 (C) Wurth Elektronik; MF: Würth Elektronik; MPN: 150066M153000
D102 D105 = main_controller:LED: LED OSRAM: - CHIPLED LG R971, LG N971, LY N971, LG Q971, LY Q971, LO R971, LY R971 LH N974, LH R974 LS Q976, LO Q976, LY Q976 LO Q996 - Hyper CHIPLED LW Q18S LB Q993, LB Q99A, LB R99A - SideLED LS A670, LO A670, LY A670, LG A670, LP A670 LB A673, LV A673, LT A673, LW A673 LH A674 LY A675 LS A676, LA A676, LO A676, LY A676, LW A676 LS A679, LY A679, LG A679 - Hyper Micro SIDELED® LS Y876, LA Y876, LO Y876, LY Y876 LT Y87S - SmartLED LW L88C, LW L88S LB L89C, LB L89S, LG L890 LS L89K, LO L89K, LY L89K LS L896, LA L896, LO L896, LY L896 - TOPLED LS T670, LO T670, LY T670, LG T670, LP T670 LSG T670, LSP T670, LSY T670, LOP T670, LYG T670 LG T671, LOG T671, LSG T671 LB T673, LV T673, LT T673, LW T673 LH T674 LS T676, LA T676, LO T676, LY T676, LB T676, LH T676, LSB T676, LW T676 LB T67C, LV T67C, LT T67C, LS T67K, LO T67K, LY T67K, LW E67C LS E67B, LA E67B, LO E67B, LY E67B, LB E67C, LV E67C, LT E67C LW T67C LS T679, LY T679, LG T679 LS T770, LO T770, LY T770, LG T770, LP T770 LB T773, LV T773, LT T773, LW T773 LH T774 LS E675, LA E675, LY E675, LS T675 LS T776, LA T776, LO T776, LY T776, LB T776 LHGB T686 LT T68C, LB T68C - Hyper Mini TOPLED® LB M676 - Mini TOPLED Santana® LG M470 LS M47K, LO M47K, LY M47K Source: http://www.osram.convergy.de LUXEON: - LUMILED® LXK2-PW12-R00, LXK2-PW12-S00, LXK2-PW14-U00, LXK2-PW14-V00 LXK2-PM12-R00, LXK2-PM12-S00, LXK2-PM14-U00 LXK2-PE12-Q00, LXK2-PE12-R00, LXK2-PE12-S00, LXK2-PE14-T00, LXK2-PE14-U00 LXK2-PB12-K00, LXK2-PB12-L00, LXK2-PB12-M00, LXK2-PB14-N00, LXK2-PB14-P00, LXK2-PB14-Q00 LXK2-PR12-L00, LXK2-PR12-M00, LXK2-PR14-Q00, LXK2-PR14-R00 LXK2-PD12-Q00, LXK2-PD12-R00, LXK2-PD12-S00 LXK2-PH12-R00, LXK2-PH12-S00 LXK2-PL12-P00, LXK2-PL12-Q00, LXK2-PL12-R00 Source: www.luxeon.com KINGBRIGHT: KA-3528ASYC Source: www.kingbright.com; MF: Würth Elektronik; MPN: 150080RS75000
D103 D106 = main_controller:LED: LED OSRAM: - CHIPLED LG R971, LG N971, LY N971, LG Q971, LY Q971, LO R971, LY R971 LH N974, LH R974 LS Q976, LO Q976, LY Q976 LO Q996 - Hyper CHIPLED LW Q18S LB Q993, LB Q99A, LB R99A - SideLED LS A670, LO A670, LY A670, LG A670, LP A670 LB A673, LV A673, LT A673, LW A673 LH A674 LY A675 LS A676, LA A676, LO A676, LY A676, LW A676 LS A679, LY A679, LG A679 - Hyper Micro SIDELED® LS Y876, LA Y876, LO Y876, LY Y876 LT Y87S - SmartLED LW L88C, LW L88S LB L89C, LB L89S, LG L890 LS L89K, LO L89K, LY L89K LS L896, LA L896, LO L896, LY L896 - TOPLED LS T670, LO T670, LY T670, LG T670, LP T670 LSG T670, LSP T670, LSY T670, LOP T670, LYG T670 LG T671, LOG T671, LSG T671 LB T673, LV T673, LT T673, LW T673 LH T674 LS T676, LA T676, LO T676, LY T676, LB T676, LH T676, LSB T676, LW T676 LB T67C, LV T67C, LT T67C, LS T67K, LO T67K, LY T67K, LW E67C LS E67B, LA E67B, LO E67B, LY E67B, LB E67C, LV E67C, LT E67C LW T67C LS T679, LY T679, LG T679 LS T770, LO T770, LY T770, LG T770, LP T770 LB T773, LV T773, LT T773, LW T773 LH T774 LS E675, LA E675, LY E675, LS T675 LS T776, LA T776, LO T776, LY T776, LB T776 LHGB T686 LT T68C, LB T68C - Hyper Mini TOPLED® LB M676 - Mini TOPLED Santana® LG M470 LS M47K, LO M47K, LY M47K Source: http://www.osram.convergy.de LUXEON: - LUMILED® LXK2-PW12-R00, LXK2-PW12-S00, LXK2-PW14-U00, LXK2-PW14-V00 LXK2-PM12-R00, LXK2-PM12-S00, LXK2-PM14-U00 LXK2-PE12-Q00, LXK2-PE12-R00, LXK2-PE12-S00, LXK2-PE14-T00, LXK2-PE14-U00 LXK2-PB12-K00, LXK2-PB12-L00, LXK2-PB12-M00, LXK2-PB14-N00, LXK2-PB14-P00, LXK2-PB14-Q00 LXK2-PR12-L00, LXK2-PR12-M00, LXK2-PR14-Q00, LXK2-PR14-R00 LXK2-PD12-Q00, LXK2-PD12-R00, LXK2-PD12-S00 LXK2-PH12-R00, LXK2-PH12-S00 LXK2-PL12-P00, LXK2-PL12-Q00, LXK2-PL12-R00 Source: www.luxeon.com KINGBRIGHT: KA-3528ASYC Source: www.kingbright.com; MF: Würth Elektronik; MPN: 150080YS75000
D104 = main_controller:LED: LED OSRAM: - CHIPLED LG R971, LG N971, LY N971, LG Q971, LY Q971, LO R971, LY R971 LH N974, LH R974 LS Q976, LO Q976, LY Q976 LO Q996 - Hyper CHIPLED LW Q18S LB Q993, LB Q99A, LB R99A - SideLED LS A670, LO A670, LY A670, LG A670, LP A670 LB A673, LV A673, LT A673, LW A673 LH A674 LY A675 LS A676, LA A676, LO A676, LY A676, LW A676 LS A679, LY A679, LG A679 - Hyper Micro SIDELED® LS Y876, LA Y876, LO Y876, LY Y876 LT Y87S - SmartLED LW L88C, LW L88S LB L89C, LB L89S, LG L890 LS L89K, LO L89K, LY L89K LS L896, LA L896, LO L896, LY L896 - TOPLED LS T670, LO T670, LY T670, LG T670, LP T670 LSG T670, LSP T670, LSY T670, LOP T670, LYG T670 LG T671, LOG T671, LSG T671 LB T673, LV T673, LT T673, LW T673 LH T674 LS T676, LA T676, LO T676, LY T676, LB T676, LH T676, LSB T676, LW T676 LB T67C, LV T67C, LT T67C, LS T67K, LO T67K, LY T67K, LW E67C LS E67B, LA E67B, LO E67B, LY E67B, LB E67C, LV E67C, LT E67C LW T67C LS T679, LY T679, LG T679 LS T770, LO T770, LY T770, LG T770, LP T770 LB T773, LV T773, LT T773, LW T773 LH T774 LS E675, LA E675, LY E675, LS T675 LS T776, LA T776, LO T776, LY T776, LB T776 LHGB T686 LT T68C, LB T68C - Hyper Mini TOPLED® LB M676 - Mini TOPLED Santana® LG M470 LS M47K, LO M47K, LY M47K Source: http://www.osram.convergy.de LUXEON: - LUMILED® LXK2-PW12-R00, LXK2-PW12-S00, LXK2-PW14-U00, LXK2-PW14-V00 LXK2-PM12-R00, LXK2-PM12-S00, LXK2-PM14-U00 LXK2-PE12-Q00, LXK2-PE12-R00, LXK2-PE12-S00, LXK2-PE14-T00, LXK2-PE14-U00 LXK2-PB12-K00, LXK2-PB12-L00, LXK2-PB12-M00, LXK2-PB14-N00, LXK2-PB14-P00, LXK2-PB14-Q00 LXK2-PR12-L00, LXK2-PR12-M00, LXK2-PR14-Q00, LXK2-PR14-R00 LXK2-PD12-Q00, LXK2-PD12-R00, LXK2-PD12-S00 LXK2-PH12-R00, LXK2-PH12-S00 LXK2-PL12-P00, LXK2-PL12-Q00, LXK2-PL12-R00 Source: www.luxeon.com KINGBRIGHT: KA-3528ASYC Source: www.kingbright.com; MF: Würth Elektronik; MPN: 150080BS75000
D201-D203 = main_controller:PTVS*S1UR; MF: Nexperia; MOUSER: 771-PTVS3V3S1UR115; MPN: PTVS3V3S1UR,115
D204 = main_controller:PTVS*S1UR; MF: Nexperia; MOUSER: 771-PTVS5V0S1UR115; MPN: PTVS5V0S1UR,115
D301 = main_controller:WE-TVS_824001: TVS Diode High Speed Series Characteristics Low clamping voltage Sturdy design Very low capacitance Flow Thru Design for a simple layout Rail to Rail protection Epoxy flame resistant UL94 V-0 RoHS, REACH and free of halogens Applications Very fast data lines USB 2.0 Ethernet PoE VGA Sim Cards Keypads ESD protection in accordance with EN 61000-4-2, – 8 kV contact discharge – 15 kV air discharge <http://katalog.we-online.de/media/images/v2/Family_WE-TVS_HIGHSPEED.jpg> Details see: http://katalog.we-online.de/en/pbs/WE-TVS_High_Speed/824001? Updated by Dan Xu 2014-07-11 2014 (C) Wurth Elektronik; MF: Würth Elektronik; MPN: 824001
IC101 = main_controller:STM32F429ZIT6: 32-Bit MCU+FPU M4 2MB LCD-TFT LQFP144 STMicroelectronics STM32F429ZIT6, 32bit ARM Cortex M4 MCU, 180MHz, 2048 kB Flash, 144-Pin LQFP Source: Datasheet <http://www.st.com/web/en/resource/technical/document/datasheet/DM00071990.pdf>; MF: STMicroelectronics; MPN: STM32F429ZIT6
IC201 = main_controller:OPA2333: Description The OPA333 series of CMOS operational amplifiers use a proprietary auto-calibration technique to simultaneously provide very low offset voltage (10 µV, max) and near-zero drift over time and temperature. These miniature, high-precision, low quiescent current amplifiers offer high-impedance inputs that have a common-mode range 100 mV beyond the rails, and rail-to-rail output that swings within 50 mV of the rails. Single or dual supplies as low as +1.8 V (±0.9 V) and up to +5.5 V (±2.75 V) can be used. These devices are optimized for low-voltage, single-supply operation. The OPA333 family offers excellent CMRR without the crossover associated with traditional complementary input stages. This design results in superior performance for driving analog-to-digital converters (ADCs) without degradation of differential linearity. The OPA333 (single version) is available in the SC70-5, SOT23-5, and SO-8 packages. The OPA2333 (dual version) is offered in DFN-8 (3 mm × 3 mm), MSOP-8, and SO-8 packages. All versions are specified for operation from –40°C to +125°C. Features Low Offset Voltage: 10 µV (max) Zero Drift: 0.05 µV/°C (max) 0.01-Hz to 10-Hz Noise: 1.1 µVPP Quiescent Current: 17 µA Single-Supply Operation Supply Voltage: 1.8 V to 5.5 V Rail-to-Rail Input/Output Size Packages: SC70 and SOT23; FARNELL: 1230455; MF: Texas Instruments; MOUSER: 595-OPA2333AIDR; MPN: OPA2333AIDR
IC202 = main_controller:STMPS2151STR; MF: STMicroelectronics; MOUSER: 511-STMPS2151STR; MPN: STMPS2151STR
J301 = main_controller:530480410; COPYRIGHT: Copyright (C) 2022 Ultra Librarian. All rights reserved.; MF: Molex Connector Corporation; MPN: 530480410
J302 J304 = main_controller:610018243021: WR-PHD 2.54mm SMT Socket Header=>Code : Con_BTB_SHD_2.54_1_SMT_610x0421821(packageing:x = 0: Tube x = 3: Tape & Reel with Cap; 600 pcs/Reel) <http://katalog.we-online.de/media/images/eican/Con_BTB_SHD_2.54_1_SMT_6100xx21821_pf2.jpg> 6100xx21821 Details see: http://katalog.we-online.de/en/em/PHD_2_54_SMT_DUAL_SOCKET_HEADER_6100XX21821 6103xx21821 Details see: http://katalog.we-online.de/en/em/PHD_2_54_SMT_DUAL_SOCKET_HEADER_REEL_6103XX21821 2014 (C) Würth Elektronik; MF: Würth Elektronik; MPN: 610018243021
J303 = main_controller:DM3AT-SF-PEJM5: CONN MICRO SD R/A PUSH-PUSH SMD; MF: Hirose Electric Co Ltd; MOUSER: 798-DM3AT-SF-PEJM5; MPN: DM3AT-SF-PEJM5
J305 = main_controller:61000618221: WR-PHD 2.54mm SMT Pin Header, 6 Pins =>Code : Con_BTB_PHD_2.54_1_SMT_61000618221 <http://katalog.we-online.de/media/images/eican/Con_BTB_PHD_2.54_1_SMT_6100xx18221_pf2.jpg> Details see: http://katalog.we-online.de/en/em/610_0xx_182_21 Created 2014-05-29, Karrer Zheng 2014 (C) Würth Elektronik; MF: Würth Elektronik; MPN: 61000618221
J306 = main_controller:623X0421021: WR-PHD 1.27mm Dual SMT Socket Header H=4.50mm, 4 Pins=>Code : Con_BTB_SHD_1.27_2_623x0421021(Packaging:x = 0: Tube x = 3: Tape & Reel with Cap) <http://katalog.we-online.de/media/thumbs2/eican/thb_Con_BTB_SHD_1.27_2_6230xx21021_pf2.jpg> 6230xx21021 Details see: http://katalog.we-online.de/en/em/PHD_1_27_SMT_DUAL_SOCKET_HEADER_6230XX21021 6233xx21021 Details see: http://katalog.we-online.de/en/em/PHD_1_27_SMT_DUAL_SOCKET_HEADER_REEL_6233XX21021 2014 (C) Würth Elektronik
L201 = main_controller:742861: WE-CBF SMD EMI Suppression Ferrite Bead Characteristics Reliable Ni-Sn electrodes High rated current up to 6 A Operating temperature: –55 ºC to +125 ºC Applications Perfect as data lined filter and for uncoupling of distribution voltage Package name and Variant abbreviation: Package: Wide Band /High Speed: W=Width= 2.2 High Current: W=Width= 2.6 Variant abbreviation: WB = Wide Band HS=High Speed HC=High Current <https://katalog.we-online.de/media/images/v2/o14753v209%20Family_WE-CBF.jpg> Details see: http://katalog.we-online.de/en/pbs/WE-CBF Updated by Ella Wu 2019-01-02 2019 (C) Wurth Elektronik; MF: Würth Elektronik; MPN: 742861160
L202 L301 = main_controller:742861: WE-CBF SMD EMI Suppression Ferrite Bead Characteristics Reliable Ni-Sn electrodes High rated current up to 6 A Operating temperature: –55 ºC to +125 ºC Applications Perfect as data lined filter and for uncoupling of distribution voltage Package name and Variant abbreviation: Package: Wide Band /High Speed: W=Width= 2.2 High Current: W=Width= 2.6 Variant abbreviation: WB = Wide Band HS=High Speed HC=High Current <https://katalog.we-online.de/media/images/v2/o14753v209%20Family_WE-CBF.jpg> Details see: http://katalog.we-online.de/en/pbs/WE-CBF Updated by Ella Wu 2019-01-02 2019 (C) Wurth Elektronik; MF: Würth Elektronik; MPN: 742861210
L302 = main_controller:WE-CNSW_1206: WE-CNSW SMD Common Mode Line Filter Characteristics High common mode noise suppression at high frequencies Small influence on high speed signals through winding symmetry Operating temperature: –40 ºC to +125 ºC (Size 0805/1206/1812); –40 ºC to +105 ºC (Size 0603) Applications USB 2.0 IEEE 1394 (Firewire) LVDS High Speed Data Lines LAN <http://katalog.we-online.de/media/images/v2/we-cnsw_stroko_smd_gruppe.jpg> Details see: http://katalog.we-online.de/en/pbs/WE-CNSW Updated by Dan Xu 2014-06-30 2014 (C) Wurth Elektronik; MF: Würth Elektronik; MPN: 744232090; WE-NUMBER: 744232090/90Ω(Z@100MHz)
R101 R104-R109 R111 R112 R301-R304 R306 R307 = resistors:R(*?): Robotics Erlangen Resistor Library This library provides a list of predefined resistors with the following features: It is guaranteed that the resistor exists with the given value, voltage rating and package size If you choose the resistor you need (e.g. 10k with at least 75V and 0.1W) the package will be automatically choosen The manufacturer's data is automatically added so that exactly that resistor will be ordered The value of the resistor will be automatically filled with the most relevant data To choose a resistor, you have to determine the maximum operating voltage and power dissipation that will be applied to that resistor in your design. With these two values you can choose the minimum package acc. to below table, which lists the maximum operating voltage and power dissipation for each package. Always try to use a package with a voltage rating of at least twice your max. operating voltage and always keep a little marging between your power dissipation and the maximum power dissipation of the package (although typically, resistors can be overloaded by a factor of five for a short time period, i.e. less than a second). Package Maximum Operating Voltage Maximum Power Dissipation 0402 ≤ 50V ≤ 62.5 mW 0603 ≤ 75V ≤ 100 mW 0805 ≤ 150V ≤ 125 mW 1206 ≤ 200V ≤ 250 mW 1210 ≤ 200V ≤ 500 mW 2512 ≤ 200V ≤ 1 W Note: If your project requires a very specific resistor (e.g. low tolerance, high voltage / power dissipation or E-24 upwards), then choose any of the predefined empty devices R(0402), R(0603), R(0805), R(1206), R(1210), or R(2512). Always set the attributes MF, MPN and VALUE for custom resistors! Never change the value of non-custom resistors!; LINE1: 1k ±1%; LINE2: 75V 0.1W; MF: YAGEO; MPN: RC0603FR-071KL; POWER: 0.1W; RESISTANCE: 1k; TOLERANCE: ±1%; VOLTAGE: 75V
R102 R103 = resistors:R(*?): Robotics Erlangen Resistor Library This library provides a list of predefined resistors with the following features: It is guaranteed that the resistor exists with the given value, voltage rating and package size If you choose the resistor you need (e.g. 10k with at least 75V and 0.1W) the package will be automatically choosen The manufacturer's data is automatically added so that exactly that resistor will be ordered The value of the resistor will be automatically filled with the most relevant data To choose a resistor, you have to determine the maximum operating voltage and power dissipation that will be applied to that resistor in your design. With these two values you can choose the minimum package acc. to below table, which lists the maximum operating voltage and power dissipation for each package. Always try to use a package with a voltage rating of at least twice your max. operating voltage and always keep a little marging between your power dissipation and the maximum power dissipation of the package (although typically, resistors can be overloaded by a factor of five for a short time period, i.e. less than a second). Package Maximum Operating Voltage Maximum Power Dissipation 0402 ≤ 50V ≤ 62.5 mW 0603 ≤ 75V ≤ 100 mW 0805 ≤ 150V ≤ 125 mW 1206 ≤ 200V ≤ 250 mW 1210 ≤ 200V ≤ 500 mW 2512 ≤ 200V ≤ 1 W Note: If your project requires a very specific resistor (e.g. low tolerance, high voltage / power dissipation or E-24 upwards), then choose any of the predefined empty devices R(0402), R(0603), R(0805), R(1206), R(1210), or R(2512). Always set the attributes MF, MPN and VALUE for custom resistors! Never change the value of non-custom resistors!; LINE1: 4R7 ±1%; LINE2: 75V 0.1W; MF: YAGEO; MPN: RC0603FR-074R7L; POWER: 0.1W; RESISTANCE: 4R7; TOLERANCE: ±1%; VOLTAGE: 75V
R110 = resistors:R(*?): Robotics Erlangen Resistor Library This library provides a list of predefined resistors with the following features: It is guaranteed that the resistor exists with the given value, voltage rating and package size If you choose the resistor you need (e.g. 10k with at least 75V and 0.1W) the package will be automatically choosen The manufacturer's data is automatically added so that exactly that resistor will be ordered The value of the resistor will be automatically filled with the most relevant data To choose a resistor, you have to determine the maximum operating voltage and power dissipation that will be applied to that resistor in your design. With these two values you can choose the minimum package acc. to below table, which lists the maximum operating voltage and power dissipation for each package. Always try to use a package with a voltage rating of at least twice your max. operating voltage and always keep a little marging between your power dissipation and the maximum power dissipation of the package (although typically, resistors can be overloaded by a factor of five for a short time period, i.e. less than a second). Package Maximum Operating Voltage Maximum Power Dissipation 0402 ≤ 50V ≤ 62.5 mW 0603 ≤ 75V ≤ 100 mW 0805 ≤ 150V ≤ 125 mW 1206 ≤ 200V ≤ 250 mW 1210 ≤ 200V ≤ 500 mW 2512 ≤ 200V ≤ 1 W Note: If your project requires a very specific resistor (e.g. low tolerance, high voltage / power dissipation or E-24 upwards), then choose any of the predefined empty devices R(0402), R(0603), R(0805), R(1206), R(1210), or R(2512). Always set the attributes MF, MPN and VALUE for custom resistors! Never change the value of non-custom resistors!; LINE1: 10k ±1%; LINE2: 75V 0.1W; MF: YAGEO; MPN: RC0603FR-0710KL; POWER: 0.1W; RESISTANCE: 10k; TOLERANCE: ±1%; VOLTAGE: 75V
R201 R202 = resistors:R(*?): Robotics Erlangen Resistor Library This library provides a list of predefined resistors with the following features: It is guaranteed that the resistor exists with the given value, voltage rating and package size If you choose the resistor you need (e.g. 10k with at least 75V and 0.1W) the package will be automatically choosen The manufacturer's data is automatically added so that exactly that resistor will be ordered The value of the resistor will be automatically filled with the most relevant data To choose a resistor, you have to determine the maximum operating voltage and power dissipation that will be applied to that resistor in your design. With these two values you can choose the minimum package acc. to below table, which lists the maximum operating voltage and power dissipation for each package. Always try to use a package with a voltage rating of at least twice your max. operating voltage and always keep a little marging between your power dissipation and the maximum power dissipation of the package (although typically, resistors can be overloaded by a factor of five for a short time period, i.e. less than a second). Package Maximum Operating Voltage Maximum Power Dissipation 0402 ≤ 50V ≤ 62.5 mW 0603 ≤ 75V ≤ 100 mW 0805 ≤ 150V ≤ 125 mW 1206 ≤ 200V ≤ 250 mW 1210 ≤ 200V ≤ 500 mW 2512 ≤ 200V ≤ 1 W Note: If your project requires a very specific resistor (e.g. low tolerance, high voltage / power dissipation or E-24 upwards), then choose any of the predefined empty devices R(0402), R(0603), R(0805), R(1206), R(1210), or R(2512). Always set the attributes MF, MPN and VALUE for custom resistors! Never change the value of non-custom resistors!; LINE1: 8M2 ±1%; LINE2: 75V 0.1W; MF: YAGEO; MPN: RC0603FR-078M2L; POWER: 0.1W; RESISTANCE: 8M2; TOLERANCE: ±1%; VOLTAGE: 75V
R203 = resistors:R(*?): Robotics Erlangen Resistor Library This library provides a list of predefined resistors with the following features: It is guaranteed that the resistor exists with the given value, voltage rating and package size If you choose the resistor you need (e.g. 10k with at least 75V and 0.1W) the package will be automatically choosen The manufacturer's data is automatically added so that exactly that resistor will be ordered The value of the resistor will be automatically filled with the most relevant data To choose a resistor, you have to determine the maximum operating voltage and power dissipation that will be applied to that resistor in your design. With these two values you can choose the minimum package acc. to below table, which lists the maximum operating voltage and power dissipation for each package. Always try to use a package with a voltage rating of at least twice your max. operating voltage and always keep a little marging between your power dissipation and the maximum power dissipation of the package (although typically, resistors can be overloaded by a factor of five for a short time period, i.e. less than a second). Package Maximum Operating Voltage Maximum Power Dissipation 0402 ≤ 50V ≤ 62.5 mW 0603 ≤ 75V ≤ 100 mW 0805 ≤ 150V ≤ 125 mW 1206 ≤ 200V ≤ 250 mW 1210 ≤ 200V ≤ 500 mW 2512 ≤ 200V ≤ 1 W Note: If your project requires a very specific resistor (e.g. low tolerance, high voltage / power dissipation or E-24 upwards), then choose any of the predefined empty devices R(0402), R(0603), R(0805), R(1206), R(1210), or R(2512). Always set the attributes MF, MPN and VALUE for custom resistors! Never change the value of non-custom resistors!; LINE1: 390k ±1%; LINE2: 75V 0.1W; MF: YAGEO; MPN: RC0603FR-07390KL; POWER: 0.1W; RESISTANCE: 390k; TOLERANCE: ±1%; VOLTAGE: 75V
R204 = resistors:R(*?): Robotics Erlangen Resistor Library This library provides a list of predefined resistors with the following features: It is guaranteed that the resistor exists with the given value, voltage rating and package size If you choose the resistor you need (e.g. 10k with at least 75V and 0.1W) the package will be automatically choosen The manufacturer's data is automatically added so that exactly that resistor will be ordered The value of the resistor will be automatically filled with the most relevant data To choose a resistor, you have to determine the maximum operating voltage and power dissipation that will be applied to that resistor in your design. With these two values you can choose the minimum package acc. to below table, which lists the maximum operating voltage and power dissipation for each package. Always try to use a package with a voltage rating of at least twice your max. operating voltage and always keep a little marging between your power dissipation and the maximum power dissipation of the package (although typically, resistors can be overloaded by a factor of five for a short time period, i.e. less than a second). Package Maximum Operating Voltage Maximum Power Dissipation 0402 ≤ 50V ≤ 62.5 mW 0603 ≤ 75V ≤ 100 mW 0805 ≤ 150V ≤ 125 mW 1206 ≤ 200V ≤ 250 mW 1210 ≤ 200V ≤ 500 mW 2512 ≤ 200V ≤ 1 W Note: If your project requires a very specific resistor (e.g. low tolerance, high voltage / power dissipation or E-24 upwards), then choose any of the predefined empty devices R(0402), R(0603), R(0805), R(1206), R(1210), or R(2512). Always set the attributes MF, MPN and VALUE for custom resistors! Never change the value of non-custom resistors!; LINE1: 820k ±1%; LINE2: 75V 0.1W; MF: YAGEO; MPN: RC0603FR-07820KL; POWER: 0.1W; RESISTANCE: 820k; TOLERANCE: ±1%; VOLTAGE: 75V
R205-R208 = resistors:R(*?): Robotics Erlangen Resistor Library This library provides a list of predefined resistors with the following features: It is guaranteed that the resistor exists with the given value, voltage rating and package size If you choose the resistor you need (e.g. 10k with at least 75V and 0.1W) the package will be automatically choosen The manufacturer's data is automatically added so that exactly that resistor will be ordered The value of the resistor will be automatically filled with the most relevant data To choose a resistor, you have to determine the maximum operating voltage and power dissipation that will be applied to that resistor in your design. With these two values you can choose the minimum package acc. to below table, which lists the maximum operating voltage and power dissipation for each package. Always try to use a package with a voltage rating of at least twice your max. operating voltage and always keep a little marging between your power dissipation and the maximum power dissipation of the package (although typically, resistors can be overloaded by a factor of five for a short time period, i.e. less than a second). Package Maximum Operating Voltage Maximum Power Dissipation 0402 ≤ 50V ≤ 62.5 mW 0603 ≤ 75V ≤ 100 mW 0805 ≤ 150V ≤ 125 mW 1206 ≤ 200V ≤ 250 mW 1210 ≤ 200V ≤ 500 mW 2512 ≤ 200V ≤ 1 W Note: If your project requires a very specific resistor (e.g. low tolerance, high voltage / power dissipation or E-24 upwards), then choose any of the predefined empty devices R(0402), R(0603), R(0805), R(1206), R(1210), or R(2512). Always set the attributes MF, MPN and VALUE for custom resistors! Never change the value of non-custom resistors!; LINE1: 470k ±1%; LINE2: 75V 0.1W; MF: YAGEO; MPN: RC0603FR-07470KL; POWER: 0.1W; RESISTANCE: 470k; TOLERANCE: ±1%; VOLTAGE: 75V
R209 R210 R305 = resistors:R(*?): Robotics Erlangen Resistor Library This library provides a list of predefined resistors with the following features: It is guaranteed that the resistor exists with the given value, voltage rating and package size If you choose the resistor you need (e.g. 10k with at least 75V and 0.1W) the package will be automatically choosen The manufacturer's data is automatically added so that exactly that resistor will be ordered The value of the resistor will be automatically filled with the most relevant data To choose a resistor, you have to determine the maximum operating voltage and power dissipation that will be applied to that resistor in your design. With these two values you can choose the minimum package acc. to below table, which lists the maximum operating voltage and power dissipation for each package. Always try to use a package with a voltage rating of at least twice your max. operating voltage and always keep a little marging between your power dissipation and the maximum power dissipation of the package (although typically, resistors can be overloaded by a factor of five for a short time period, i.e. less than a second). Package Maximum Operating Voltage Maximum Power Dissipation 0402 ≤ 50V ≤ 62.5 mW 0603 ≤ 75V ≤ 100 mW 0805 ≤ 150V ≤ 125 mW 1206 ≤ 200V ≤ 250 mW 1210 ≤ 200V ≤ 500 mW 2512 ≤ 200V ≤ 1 W Note: If your project requires a very specific resistor (e.g. low tolerance, high voltage / power dissipation or E-24 upwards), then choose any of the predefined empty devices R(0402), R(0603), R(0805), R(1206), R(1210), or R(2512). Always set the attributes MF, MPN and VALUE for custom resistors! Never change the value of non-custom resistors!; LINE1: 0R ±1%; LINE2: 75V 0.1W; MF: YAGEO; MPN: RC0603FR-070RL; POWER: 0.1W; RESISTANCE: 0R; TOLERANCE: ±1%; VOLTAGE: 75V
S101 = main_controller:452403012014: WS-SLSV Slide Switch, SMD version, same side connection Specification Rating : 300mA, 6VDC Contact Resistance Initial: 50mΩ max. After life test: 200mΩ max. Insulation Resistance: min.100MΩ at 500VDC Dielectric Strength : 500VAC for 1 minute Total-Travel : 2.0±0.2mm Operation Force :200 ±150g Life cycle : :20,000 steps Switch function :ON-ON Material Cover : : Stainless steel Base :PA9T UL 94 V-0, color Black. Actuator :LCP UL 94 V-0, color Black Contact : :Copper Alloy with Silver Terminal : Copper Alloy with Silver <http://katalog.we-online.de/media/images/v2/Family_WS-SLSV_452403012014.jpg> Details see: http://katalog.we-online.de/en/em/SLSV_7_65X_5_5_SMD_VERTICAL?sid=d553d9ab8e 2015 (C) Würth Elektronik; MF: Würth Elektronik; MPN: 452403012014
S102 = main_controller:428542320816: 7x7 mm washable SMD arrow type WS-ROSV <http://katalog.we-online.de/media/images/v2/Family_WS-ROSV_SMD_Rotary_Switch_428542320810.jpg> Details see: http://katalog.we-online.de/en/em/ROSV_7X7_WASHABLE_SMD_ARROW_TYPE 2015 (C) Würth Elektronik; MF: Würth Elektronik; MPN: 428542320816
SV301 = main_controller:MA08-2: PIN HEADER; MF: Würth Elektronik; MPN: 61301621121
U101 = main_controller:SN74AHC1G125DBV; MF: Texas Instruments; MOUSER: 595-SN74AHC1G125DBVR; MPN: SN74AHC1G125DBVR
U201 = main_controller:ICM20609; MF: TDK InvenSense; MOUSER: 410-ICM-20609; MPN: ICM20609
Y101 = main_controller:83020*09; MF: Würth Elektronik; MPN: 830207192009
Z301-Z307 = main_controller:ESD8704; MF: ON Semiconductor; MOUSER: 863-ESD8704MUTAG; MPN: ESD8704MUTAG

## Net classes
0 default: width 0.254 mm, drill 0.3 mm, clearance 0.1 mm